# EAGLE design water ver3.0.0 (EAGLE 9.6.2)
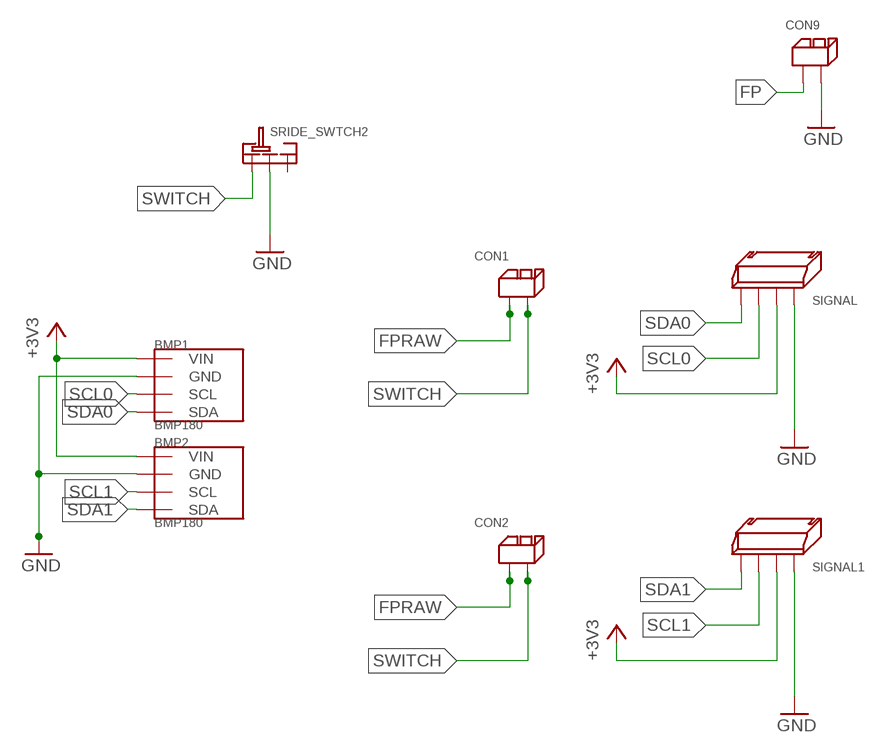
[diagram p0: schematic, sheet 1]

## Parts
BMP1  BMP180  [GY-68]
BMP2  BMP180  [GY-68]
CON1  2PIN  [2PIN]
CON2  2PIN  [2PIN]
CON9  2PIN  [2PIN]
SIGNAL  4PIN_SIDE  [4PIN_SIDE]
SIGNAL1  4PIN_SIDE  [4PIN_SIDE]
SRIDE_SWTCH2  SRIDE_SWITCH  [SRIDE_SWITCH]

## Nets
+3V3: BMP1.P1(VIN) BMP2.P1(VIN) SIGNAL1.P$3 SIGNAL.P$3
FP: CON9.P$1
FPRAW: CON1.P$1 CON2.P$1
GND: BMP1.P2(GND) BMP2.P2(GND) CON9.P$2 SIGNAL1.P$4 SIGNAL.P$4 SRIDE_SWTCH2.LR
SCL0: BMP1.P3(SCL) SIGNAL.P$1
SCL1: BMP2.P3(SCL) SIGNAL1.P$1
SDA0: BMP1.P4(SDA) SIGNAL.P$2
SDA1: BMP2.P4(SDA) SIGNAL1.P$2
SWITCH: CON1.P$2 CON2.P$2 SRIDE_SWTCH2.L
Unconnected: SRIDE_SWTCH2.R

## Library data of the parts
BMP1 BMP2 = BMP180:BMP180
CON1 CON2 CON9 = XR Connector:2PIN
SIGNAL SIGNAL1 = XR Connector:4PIN_SIDE
SRIDE_SWTCH2 = Sride Switch:SRIDE_SWITCH

## Board
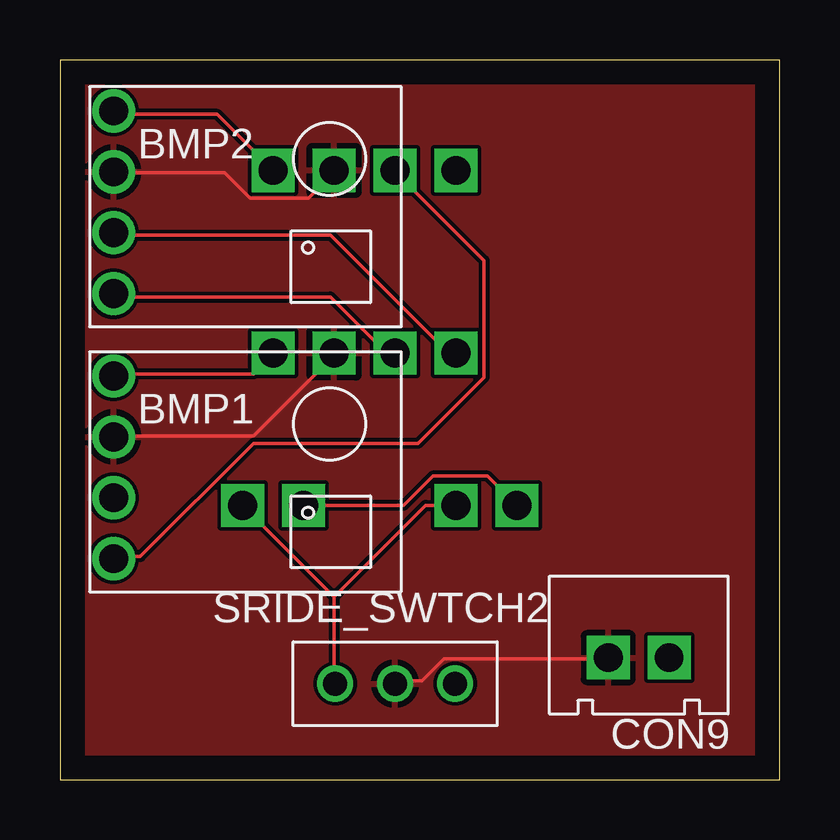
[diagram p1: board, top side]
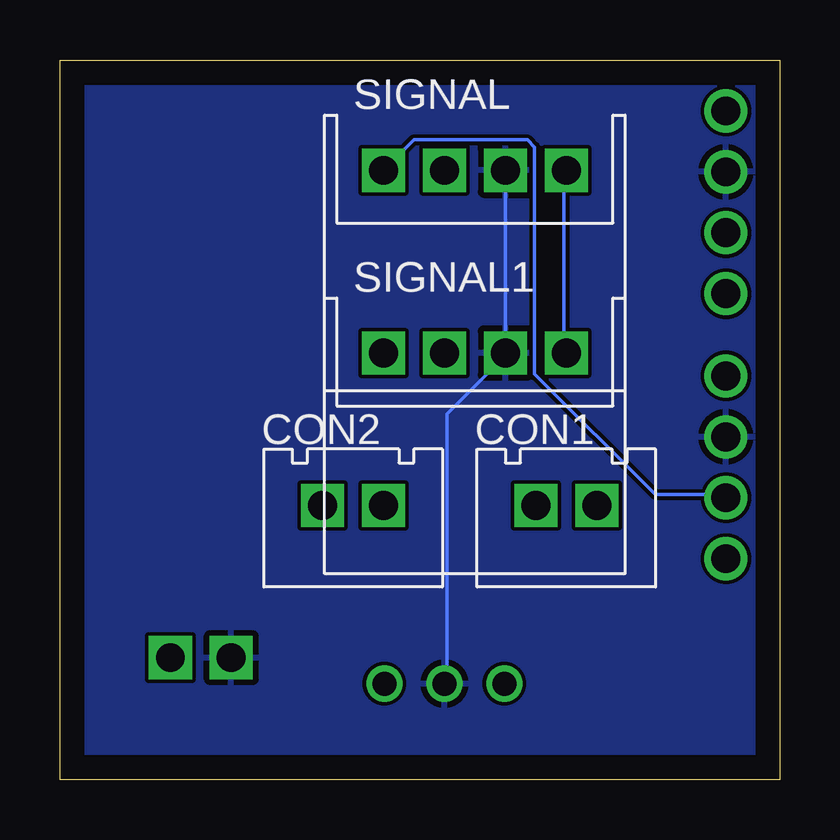
[diagram p2: board, bottom side, seen from below]

Size 30 x 30 mm. Coordinates in mm from the lower left corner, seen from the top.
Outline: 0,0 30,0 30,30 0,30 0,0
Copper layers (1*16): Top 0.035mm / dielectric 1.5mm / Bottom 0.035mm
Design rules "default": minimum track width 6mil, minimum drill 0.35mm, track to track 6mil, track to pad 6mil, pad to pad 6mil, via to via 6mil, smd to smd 6mil, copper to edge 40mil, drill to drill 6mil, minimum pad ring 10mil, minimum via ring 8mil, stop-mask expansion 4mil, vias tented up to drill 0mil, thermal gap 10mil

### Footprints (pad centres in the part's own frame; a part is rotated, then mirrored left to right if it is on the bottom)
GY-68 = drill 1.2: P1 -5,4; P2 -5,1.46; P3 -5,-1.08; P4 -5,-3.62
2PIN = drill 1.2 square: P$1 -1.27,0; P$2 1.27,0
4PIN_SIDE = drill 1.2 square: P$1 -3.81,0; P$2 -1.27,0; P$3 3.81,0; P$4 1.27,0
SRIDE_SWITCH = drill 1: L -2.5,0; LR 0,0; R 2.5,0

### Placement (x,y rotation side)
BMP1  7.24,12.83 0 top
BMP2  7.24,23.88 0 top
CON1  8.89,11.43 0 bottom
CON2  17.78,11.43 0 bottom
CON9  24.13,5.08 180 top
SIGNAL  12.7,25.4 0 bottom
SIGNAL1  12.7,17.78 0 bottom
SRIDE_SWTCH2  13.97,4 0 top

### Tracks (layer width: path | path; a pad name or v marks a point on that pad's centre or on a via)
+3V3
  Top 0.152: BMP1.P1 2.29,16.92 8.08,16.92 8.84,17.68 SIGNAL1.P$3 | SIGNAL.P$3 6.55,27.74 2.29,27.74 BMP2.P1
  Bottom 0.152: SIGNAL1.P$3 8.99,17.83 8.99,25.3 SIGNAL.P$3
FPRAW
  Top 0.152: CON1.P$1 14.33,11.43 15.54,12.65 17.83,12.65 CON2.P$1
GND
  Top 0.152: BMP2.P2 2.29,25.3 6.86,25.3 7.92,24.23 10.36,24.23 11.43,25.3 SIGNAL.P$4 | SRIDE_SWTCH2.LR 14.02,4.12 15.09,4.12 16,5.03 22.86,5.03 CON9.P$2 | BMP1.P2 2.29,14.33 8.08,14.33 11.43,17.68 SIGNAL1.P$4
  Bottom 0.152: SRIDE_SWTCH2.LR 13.87,4.12 13.87,15.24 11.43,17.68 SIGNAL1.P$4 SIGNAL.P$4
  pour Top: -2.54,31.75 31.75,31.75 31.75,-1.27 -2.54,-1.27
  pour Bottom: -5.08,33.02 33.02,33.02 33.02,-2.54 -5.08,-2.54
SCL0
  Bottom 0.152: SIGNAL.P$1 15.24,26.67 10.52,26.67 10.21,26.36 10.21,16.92 5.18,11.89 2.29,11.89 BMP1.P3
SCL1
  Top 0.152: SIGNAL1.P$1 16.46,17.83 16.15,17.83 11.28,22.71 2.29,22.71 BMP2.P3
SDA0
  Top 0.152: BMP1.P4 2.29,9.3 3.35,9.3 8.08,14.02 14.94,14.02 17.68,16.76 17.68,21.64 14.02,25.3 SIGNAL.P$2
SDA1
  Top 0.152: SIGNAL1.P$2 13.87,17.83 13.56,17.83 11.28,20.12 2.29,20.12 BMP2.P4
SWITCH
  Top 0.152: 11.43,7.62 11.43,4.12 SRIDE_SWTCH2.L | CON1.P$2 11.43,7.62 | CON2.P$2 15.24,11.43 11.43,7.62